# Altium project jetski-middleman.PrjPcb
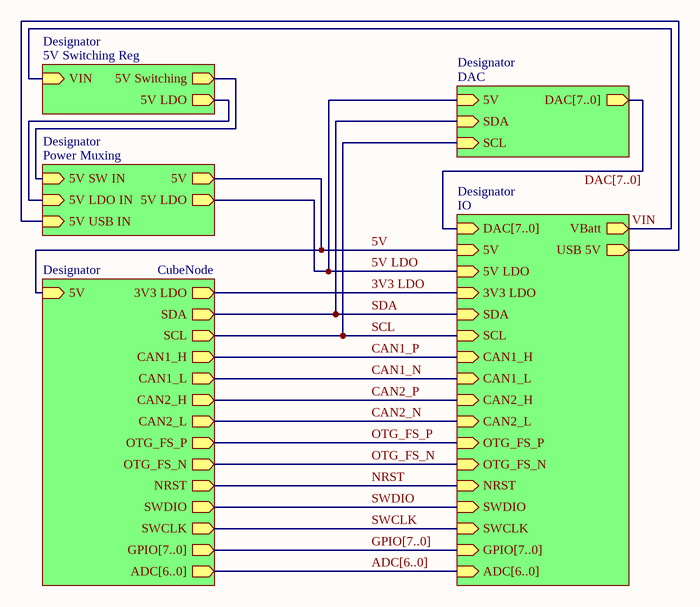
[diagram p0: top.SchDoc]
6 sheets, 37 parts. Net scope: hierarchical (ports join the sheet entries above them; power ports are global).
Board file: main.PcbDoc
Sheets:
  top.SchDoc
    Designator = 5V Switching Reg.SchDoc
    Designator = DAC.SchDoc
    Designator = IO.SchDoc
    Designator = CubeNode.SchDoc
    Designator = Power Muxing.SchDoc

## Sheet top.SchDoc
size A4; SheetNumber: 1; SheetTotal: 6

### Sub-sheets
Designator = 5V Switching Reg: 5V Switching (out), VIN (in), 5V LDO (out)
Designator = DAC: SCL (in), SDA (in), 5V (in), DAC[7..0] (out)
Designator = IO: DAC[7..0] (in), 5V LDO (in), VBatt (out), 5V (in), USB 5V (out), SDA (in), SCL (in), GPIO[7..0] (in), CAN1_H (in), CAN1_L (in), OTG_FS_P (in), OTG_FS_N (in), ADC[6..0] (in), CAN2_H (in), CAN2_L (in), SWDIO (in), SWCLK (in), NRST (in), 3V3 LDO (in)
Designator = CubeNode: 5V (in), 3V3 LDO (out), GPIO[7..0] (out), ADC[6..0] (out), SWDIO (out), SWCLK (out), SDA (out), SCL (out), CAN1_H (out), CAN1_L (out), OTG_FS_P (out), OTG_FS_N (out), CAN2_H (out), CAN2_L (out), NRST (out)
Designator = Power Muxing: 5V USB IN (in), 5V SW IN (in), 5V (out), 5V LDO (out), 5V LDO IN (in)

### Nets
3V3 LDO: sheet Designator/3V3 LDO, sheet Designator/3V3 LDO
5V: sheet Designator/5V Switching, sheet Designator/5V SW IN
5V: sheet Designator/5V, sheet Designator/5V, sheet Designator/5V  [a separate net that carries the same name]
5V LDO: sheet Designator/5V, sheet Designator/5V LDO, sheet Designator/5V LDO  [project net 5V]
5V USB IN: sheet Designator/USB 5V, sheet Designator/5V USB IN
CAN1_N: sheet Designator/CAN1_L, sheet Designator/CAN1_L
CAN1_P: sheet Designator/CAN1_H, sheet Designator/CAN1_H
CAN2_N: sheet Designator/CAN2_L, sheet Designator/CAN2_L
CAN2_P: sheet Designator/CAN2_H, sheet Designator/CAN2_H
NRST: sheet Designator/NRST, sheet Designator/NRST
OTG_FS_N: sheet Designator/OTG_FS_N, sheet Designator/OTG_FS_N
OTG_FS_P: sheet Designator/OTG_FS_P, sheet Designator/OTG_FS_P
SCL: sheet Designator/SCL, sheet Designator/SCL, sheet Designator/SCL
SDA: sheet Designator/SDA, sheet Designator/SDA, sheet Designator/SDA
SWCLK: sheet Designator/SWCLK, sheet Designator/SWCLK
SWDIO: sheet Designator/SWDIO, sheet Designator/SWDIO
VIN: sheet Designator/VIN, sheet Designator/VBatt
NetC7_1: sheet Designator/5V LDO, sheet Designator/5V LDO IN

### Buses and harness runs
bus ADC[6..0] = sheet Designator/ADC[6..0]
bus DAC[7..0] = sheet Designator/DAC[7..0]
bus GPIO[7..0] = sheet Designator/GPIO[7..0]

## Sheet 5V Switching Reg.SchDoc
size A4; SheetNumber: 4; SheetTotal: 6
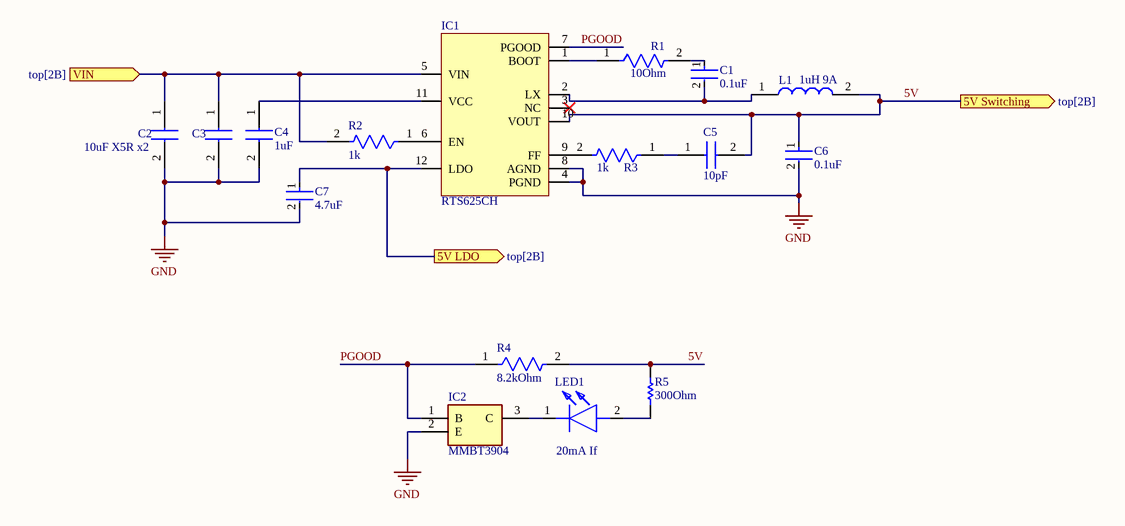
[diagram p1: 5V Switching Reg.SchDoc]

### Parts
(Parts that share a designator on the sheet are numbered #1, #2 ... from top to bottom, then left to right.)
C1#1  0.1uF  [FP-C0603C-CF-MFG]
C2#1  10uF X5R x2  [CAPC1608X90N]
C3  10uF X5R  [CAPC1608X90N]  (value not drawn)
C4  1uF  [CAPC1608X90N]
C5  10pF  [CAPC1608X95N]
C6  0.1uF  [FP-C0603C-CF-MFG]
C7  4.7uF  [FP-CL10-IPC_C]
IC1  RTS625CH  [RT6258C]
IC2#1  MMBT3904  [SOT95P240X120-3N]
L1  1uH 9A  [IFDC3030EZER1R0N]
LED1  20mA If  [KGEELP4122PHRH35A8J820R18]
R1  10Ohm  [FP-CRCW0603-C-MFG]
R2  1k  [FP-RC0603-0_55-IPC_C]
R3  1k  [FP-RC0603-0_55-IPC_C]
R4  8.2kOhm  [FP-RC0603-0_55-MFG]
R5  300Ohm  [RESC1608X55X30LL20T20]

### Ports
5V LDO (out, see top[2B]), 5V Switching (out, see top[2B]), VIN (in, see top[2B])

### Nets
GND: C2#1.2 C3.2 C4.2 C6.2 C7.2 IC1.4(PGND) IC1.8(AGND) IC2#1.2(E)
5V: C5.2 C6.1 IC1.10(VOUT) L1.2 R4.2 R5.2 ; port 5V Switching
PGOOD: IC1.7(PGOOD) IC2#1.1(B) R4.1
VIN: C2#1.1 C3.1 IC1.5(VIN) R2.2 ; port VIN
NetC1#1_1: C1#1.1 R1.2
NetC1#1_2: C1#1.2 IC1.2(LX) L1.1
NetC4_1: C4.1 IC1.11(VCC)
NetC5_1: C5.1 R3.1
NetC7_1: C7.1 IC1.12(LDO) ; port 5V LDO
NetIC1_1: IC1.1(BOOT) R1.1
NetIC1_6: IC1.6(EN) R2.1
NetIC1_9: IC1.9(FF) R3.2
NetIC2#1_3: IC2#1.3(C) LED1.1(K)
NetLED1_2: LED1.2(A) R5.1

Not connected (* = marked no-connect by the designer): IC1 3(NC)*

### Library data of the parts
C1#1 C6 = CMP-2006-03057-2: CAP CER 0.1UF 25V X7R 0603; Manufacturer Part Number: C0603C104K3RACTU; Manufacturer: KEMET; Value: 0.10 μF; Material: Ceramic; Tolerance: 0.1; Temperature Coefficient: 30ppm/°C; Automotive Grade: Grade 1; Lead Free: Yes; Device Class L3: Ceramic Capacitors; Voltage Rating: 25 V; Digikey Description: CAP CER 0.1UF 25V X7R 0603; Mouser Description: Multilayer Ceramic Capacitors MLCC - SMD/SMT 25volts 0.1uF X7R 10%; Package: C0603C-CF; Temperature Range Low: -55°C; Automotive: Yes; Device Class L2: Capacitors; Octopart: https://octopart.com/c0603c104k3ractu-kemet-127541; ComponentLink2Description: Datasheet; ComponentLink2URL: https://api.kemet.com/component-edge/download/datasheet/C0603C100J5GACAUTO.pdf; Temperature Range High: +125°C; RoHS: TRUE; Device Class L1: Passive Components; Category: Cap; Temperature: -55°C to +125°C; Capacitance: 0.10 μF; Height: 0.87mm; Temperature Characteristic: X7R
C2#1 C3 = CL10A106MA8NRNC: Capacitor; Manufacturer_Name: SAMSUNG; Datasheet Link: https://www.arrow.com/en/products/cl10a106ma8nrnc/samsung-electro-mechanics; Height: 0.9mm; Manufacturer_Part_Number: CL10A106MA8NRNC; Mouser Part Number: 187-CL10A106MA8NRNC; Mouser Price/Stock: https://www.mouser.co.uk/ProductDetail/Samsung-Electro-Mechanics/CL10A106MA8NRNC?qs=47mY1nHWefS2vFRvRJVTdQ%3D%3D; Arrow Part Number: CL10A106MA8NRNC; Arrow Price/Stock: https://www.arrow.com/en/products/cl10a106ma8nrnc/samsung-electro-mechanics?utm_currency=USD&region=nac
C4 = EMK107B7105KA-T: Capacitor; Manufacturer_Name: TAIYO YUDEN; Datasheet Link: https://componentsearchengine.com/Datasheets/1/EMK107B7105KA-T.pdf; Height: 0.9mm; Manufacturer_Part_Number: EMK107B7105KA-T; Mouser Part Number: 963-EMK107B7105KA-T; Mouser Price/Stock: https://www.mouser.co.uk/ProductDetail/TAIYO-YUDEN/EMK107B7105KA-T?qs=I6KAKw0tg2zS1zj87Lm%2FxQ%3D%3D
C5 = 0603N100J500CT: Capacitor; Manufacturer_Name: Walsin Technology Corporation; Datasheet Link: https://datasheet.datasheetarchive.com/originals/distributors/DKDS41/DSANUWW0027552.pdf; Height: 0.95mm; Manufacturer_Part_Number: 0603N100J500CT; Mouser Part Number: 791-0603N100J500CT; Mouser Price/Stock: https://www.mouser.co.uk/ProductDetail/Walsin/0603N100J500CT?qs=t1sE%252BOcWp5sS3BuqSvZ7LQ%3D%3D
C7 = CMP-13271-003017-1: Cap Ceramic 4.7uF 10V X5R ±10% Pad SMD 0603 +85°C T/R; Capacitance: 4.7uF; Case/Package: 0603; Packaging: Tape and Reel; Width: 0.031inch; Contact Plating: Tin; Thickness: 0.035inch; Package Quantity: 1; Voltage Rating: 10V; Case Code (Metric): 1608; Case Code (Imperial): 0603; Depth: 0.8mm; Height: 0.8mm; Tolerance: 10%; Max Operating Temperature: 85°C; Length: 1.6mm; Dielectric: X5R; Mount: Surface Mount; Radiation Hardening: No; Min Operating Temperature: -55°C
IC1 = RTS625CH: 5V6A SWITCHING REG WITH 5V LDO
IC2#1 = MMBT3904: Integrated Circuit; Manufacturer_Name: Diotec; Datasheet Link: https://media.digikey.com/pdf/Data%20Sheets/ON%20Semiconductor%20PDFs/2N3904,MMBT3904,PZT3904.pdf; Height: 1.2mm; Manufacturer_Part_Number: MMBT3904; Mouser Part Number: 637-MMBT3904; Mouser Price/Stock: https://www.mouser.co.uk/ProductDetail/Diotec-Semiconductor/MMBT3904?qs=OlC7AqGiEDkK1MwiyUU6mg%3D%3D; Arrow Part Number: MMBT3904; Arrow Price/Stock: https://www.arrow.com/en/products/mmbt3904/diotec-semiconductor-ag?utm_currency=USD&region=europe
L1 = IFDC3030EZER1R0N: Inductor; Manufacturer_Name: Vishay; Datasheet Link: https://www.mouser.pl/ProductDetail/Vishay/IFDC3030EZER1R0N?qs=iLKYxzqNS76W2wwIdyJsOA%3D%3D&srsltid=AfmBOoplWxOmL_1KN57dRWQGL9gAV5jJY47jYKvTr8QJ9T9ueMB2OGhk; Height: 5mm; Manufacturer_Part_Number: IFDC3030EZER1R0N; Mouser Part Number: 70-IFDC3030EZER1R0N; Mouser Price/Stock: https://www.mouser.co.uk/ProductDetail/Vishay-Dale/IFDC3030EZER1R0N?qs=iLKYxzqNS76W2wwIdyJsOA%3D%3D
LED1 = KG_EELP41.22-PHRH-35-A8J8-20-R18: LED; Manufacturer_Name: ams OSRAM; Manufacturer_Part_Number: KG EELP41.22-PHRH-35-A8J8-20-R18; Datasheet Link: https://www.farnell.com/datasheets/4386962.pdf?_gl=1*1sj7xoj*_gcl_aw*R0NMLjE3Mzc3MDQxMzMuRUFJYUlRb2JDaE1JdjdQa2l1eU5pd01WV291REJ4MzJTQ3RhRUFBWUFpQUFFZ0xCUGZEX0J3RQ..*_gcl_au*OTQ1Mjk2NjYxLjE3MzU1NTg3NDQ.; Height: 0.5mm; Mouser Part Number: 720-P4122PHRH35A8J82; Mouser Price/Stock: https://www.mouser.co.uk/ProductDetail/ams-OSRAM/KG-EELP41.22-PHRH-35-A8J8-20-R18?qs=ZcfC38r4Posajg8ZvCDQkg%3D%3D; Arrow Part Number: KG EELP41.22-PHRH-35-A8J8-20-R18; Arrow Price/Stock: https://www.arrow.com/en/products/kg-eelp41.22-phrh-35-a8j8-20-r18/ams-osram?utm_currency=USD&region=nac
R1 = CMP-02407-011565-1: RES SMD 10 OHM 1% 1/10W 0603; Resistance: 10R; Power Rating: 100mW; Lead Free: Lead Free; Case/Package: 0603; RoHS Compliant: Yes; Tolerance: 1%
R2 R3 = CMP-1659-00009-5: RES 1K OHM 1% 1/10W 0603; Resistance: 1kR; Voltage Rating: 50V; Power Rating: 100mW; Temperature Coefficient: 100ppm/°C; Military Standard: Not; REACH SVHC: No SVHC; Size Code: 0603; Features: Moisture Resistant; Number of Terminations: 2; Technology: THICK FILM; Series: RC; Case Code (Metric): 1608; Resistance Tolerance: 1%; Resistor Type: Thick Film; Termination: SMD/SMT; Contact Plating: Tin; Radiation Hardening: No; Min Operating Temperature: -55°C; Max Operating Temperature: 155°C; Packaging: Tape and Reel; Max Power Dissipation: 100mW; RoHS Compliant: Yes; Height: 0.45mm; Lead Free: Lead Free; Case/Package: 0603; Length: 1.6mm; Tolerance: 1%; Case Code (Imperial): 0603; Construction: Rectangular; Depth: 0.8mm
R4 = CMP-1659-00040-2: NexarPartId: 40301092; Voltage Rating (AC): 50V; Resistance: 8.2kΩ; Power Rating: 100mW; Temperature Coefficient: 100ppm/°C; Tolerance: 1%; Number of Terminations: 2; Length: 1.6mm; Height: 450µm; Composition: Thick Film; Case Code (Imperial): 0603; Features: Moisture Resistant; Width: 800µm; Max Operating Temperature: 155°C; Lead Pitch: 300µm; Voltage Rating: 50V; Termination: SMD/SMT; Case Code (Metric): 1608; Max Power Dissipation: 100mW; REACH SVHC: No SVHC; Number of Pins: 2; Min Operating Temperature: -55°C; Case/Package: 0603; Packaging: Tape & Reel; Voltage Rating (DC): 50V; Schedule B: 8533210045, 8533210045; Lead Free: Lead Free; RoHS: Compliant; Military Standard: Not; Depth: 800µm
R5 = CMP-2000-00025-1: Part Number: ERA3AEB301V; Manufacturer: Panasonic

## Sheet DAC.SchDoc
size A4; SheetNumber: 5; SheetTotal: 6
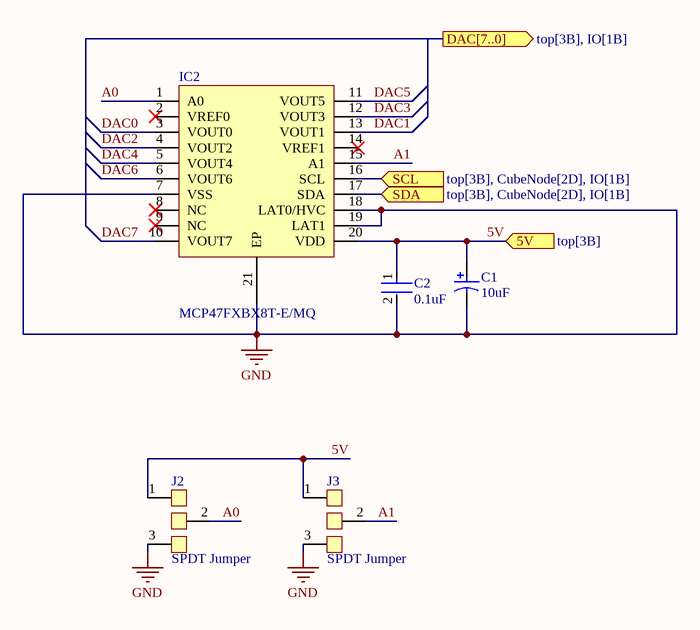
[diagram p2: DAC.SchDoc]

### Parts
(Parts that share a designator on the sheet are numbered #1, #2 ... from top to bottom, then left to right.)
C1#2  10uF  [KEMT-A-3216-18-2_M]
C2#2  0.1uF  [FP-GRM033-0_03-MFG]
IC2#2  MCP47FXBX8T-E/MQ  [MCP47FXBX8T-E/MQ]
J2  SPDT Jumper  [SPDT Jumper]
J3#1  SPDT Jumper  [SPDT Jumper]

### Ports
5V (in, see top[3B]), DAC[7..0] (out, see top[3B], IO[1B]), SCL (in, see top[3B], CubeNode[2D], IO[1B]), SDA (in, see top[3B], CubeNode[2D], IO[1B])

### Nets
GND: C1#2.2 C2#2.2 IC2#2.7(VSS) IC2#2.18(LAT0/HVC) IC2#2.19(LAT1) IC2#2.21(EP) J2.3 J3#1.3
5V: C1#2.1 C2#2.1 IC2#2.20(VDD) J2.1 J3#1.1 ; port 5V
A0: IC2#2.1(A0) J2.2
A1: IC2#2.15(A1) J3#1.2
DAC0: IC2#2.3(VOUT0)
DAC1: IC2#2.13(VOUT1)
DAC2: IC2#2.4(VOUT2)
DAC3: IC2#2.12(VOUT3)
DAC4: IC2#2.5(VOUT4)
DAC5: IC2#2.11(VOUT5)
DAC6: IC2#2.6(VOUT6)
DAC7: IC2#2.10(VOUT7)
SCL: IC2#2.16(SCL) ; port SCL
SDA: IC2#2.17(SDA) ; port SDA

Not connected (* = marked no-connect by the designer): IC2#2 2(VREF0)* 8(NC)* 9(NC)* 14(VREF1)*

### Library data of the parts
C1#2 = CMP-2000-05172-1: Capacitor, Tantalum, 10 uF, +/- 10%, 10 V, -55 to 125 degC, 2-Pin SMD (1206), RoHS, Tape and Reel; Manufacturer Size Code: A; Manufacturer: Kemet; Type: Molded; Online Catalog: T491Series; Other Names: 399-3684-2; Voltage - Rated: 10V; Lifetime @ Temp.: 2000Hrs@85degC; Product Training Modules: CapacitorBasics-TypicalUsesforCapacitorsDeratingGuidelinesforSurfaceMountTantalumCapacitors; ESR (Equivalent Series Resistance): 3.8Ohm; Capacitance: 10µF; Catalog Drawings: T49x,T5xxSeries_A-side1T49x,T5xxSeries_A,B-side2T49x,T5xxSeries_A,SBottom; Family: TantalumCapacitors; Manufacturer URL: http://www.kemet.com/; Datasheet URL: http://www.farnell.com/datasheets/1824869.pdf; Package Reference: 1206; Packaging: Tape&Reel(TR); Series: T491; Operating Temperature: -55degC~125degC; Mounting Type: SurfaceMount; Height - Seated (Max): 0.071"(1.80mm); Package / Case: 1206(3216Metric); Package Description: 2-Pin Surface Mount Device, Body 3.2 x 1.6 mm; Features: GeneralPurpose; Tolerance: ±10%; Lead Spacing: -; Size / Dimension: 0.126"Lx0.063"W(3.20mmx1.60mm); Standard Package: 2,000; Datasheet Version: Apr-14; Category: Capacitors
C2#2 = CMP-06035-000062-2: Chip Multilayer Ceramic Capacitors for General Purpose, 0201, 0.10uF, X5R, 15%, 10%, 6.3V; Capacitance: 100nF; Min Operating Temperature: -55°C; Lead Free: Lead Free; Radiation Hardening: No; Dielectric: X5R; Voltage Rating (DC): 6.3V; REACH SVHC: No SVHC; Case/Package: 0201; Voltage Rating: 6.3V; Length: 0.6mm; Max Operating Temperature: 85°C; Width: 0.012inch; Depth: 0.3mm; Material: Ceramic; Case Code (Metric): 0603; Thickness: 0.013inch; Packaging: Tape and Reel; Height: 0.3mm; Weight: 6E-06oz; Package Quantity: 1; Mount: Surface Mount; Voltage: 6.3V; Case Code (Imperial): 0201; Tolerance: 10%; Termination: SMD/SMT

## Sheet IO.SchDoc
size A4; SheetNumber: 3; SheetTotal: 6
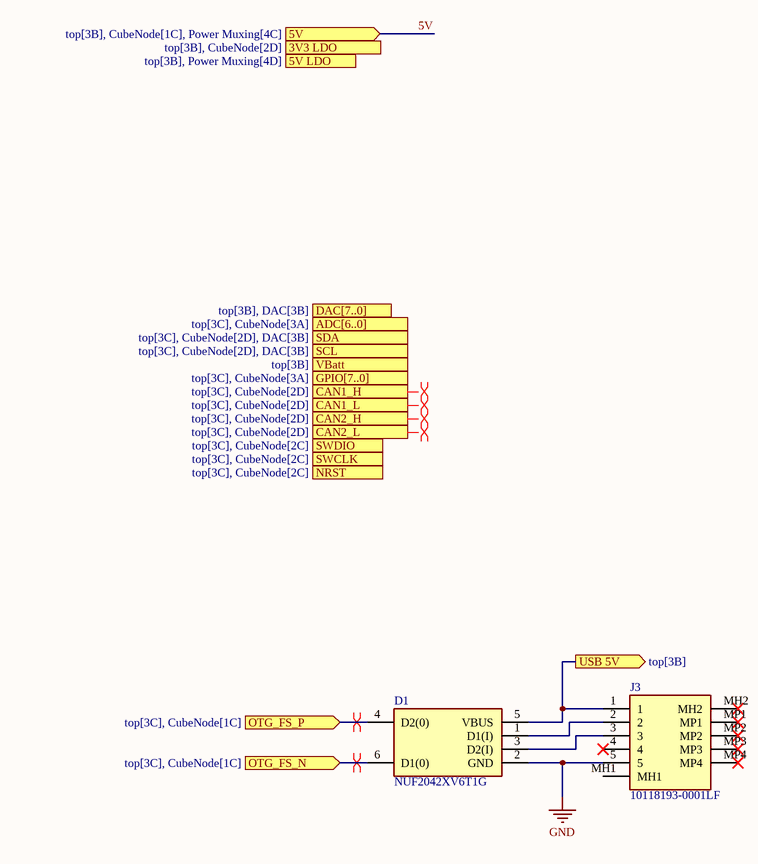
[diagram p3: IO.SchDoc]

### Parts
(Parts that share a designator on the sheet are numbered #1, #2 ... from top to bottom, then left to right.)
D1  NUF2042XV6T1G  [SOTFL50P160X60-6N]
J3#2  10118193-0001LF  [101181930001LF]

### Ports
3V3 LDO (in, see top[3B], CubeNode[2D]), 5V (in, see top[3B], CubeNode[1C], Power Muxing[4C]), 5V LDO (in, see top[3B], Power Muxing[4D]), ADC[6..0] (in, see top[3C], CubeNode[3A]), CAN1_H (in, see top[3C], CubeNode[2D]), CAN1_L (in, see top[3C], CubeNode[2D]), CAN2_H (in, see top[3C], CubeNode[2D]), CAN2_L (in, see top[3C], CubeNode[2D]), DAC[7..0] (in, see top[3B], DAC[3B]), GPIO[7..0] (in, see top[3C], CubeNode[3A]), NRST (in, see top[3C], CubeNode[2C]), OTG_FS_N (in, see top[3C], CubeNode[1C]), OTG_FS_P (in, see top[3C], CubeNode[1C]), SCL (in, see top[3C], CubeNode[2D], DAC[3B]), SDA (in, see top[3C], CubeNode[2D], DAC[3B]), SWCLK (in, see top[3C], CubeNode[2C]), SWDIO (in, see top[3C], CubeNode[2C]), USB 5V (out, see top[3B]), VBatt (out, see top[3B])

### Nets
GND: D1.2(GND) J3#2.5
5V USB IN: D1.5(VBUS) J3#2.1 ; port USB 5V
OTG_FS_N: D1.6(D1(0)) ; port OTG_FS_N
OTG_FS_P: D1.4(D2(0)) ; port OTG_FS_P
NetD1_1: D1.1(D1(I)) J3#2.2
NetD1_3: D1.3(D2(I)) J3#2.3

Not connected (* = marked no-connect by the designer): J3#2 4* MH1 MH2* MP1* MP2* MP3* MP4*

### Layout directives
differential pair: CAN1_N, CAN1_P, CAN2_N, CAN2_P, OTG_FS_N, OTG_FS_P

### Library data of the parts
D1 = NUF2042XV6T1G: Diode; Manufacturer_Name: onsemi; Datasheet Link: https://www.onsemi.com/pub/Collateral/NUF2030XV6-D.PDF; Height: 0.6mm; Manufacturer_Part_Number: NUF2042XV6T1G; Mouser Part Number: 863-NUF2042XV6T1G; Mouser Price/Stock: https://www.mouser.co.uk/ProductDetail/onsemi/NUF2042XV6T1G?qs=ZXBb0xZ9WeAV3XcAwewBSw%3D%3D; Arrow Part Number: NUF2042XV6T1G; Arrow Price/Stock: https://www.arrow.com/en/products/nuf2042xv6t1g/on-semiconductor?region=europe
J3#2 = 10118193-0001LF: Connector; Manufacturer_Name: Amphenol Communications Solutions; Datasheet Link: https://cdn.amphenol-cs.com/media/wysiwyg/files/drawing/10118193.pdf; Height: 3.3mm; Manufacturer_Part_Number: 10118193-0001LF; Arrow Part Number: 10118193-0001LF; Arrow Price/Stock: https://www.arrow.com/en/products/10118193-0001lf/amphenol-fci?utm_currency=USD&region=europe

## Sheet CubeNode.SchDoc
size A4; SheetNumber: 2; SheetTotal: 6
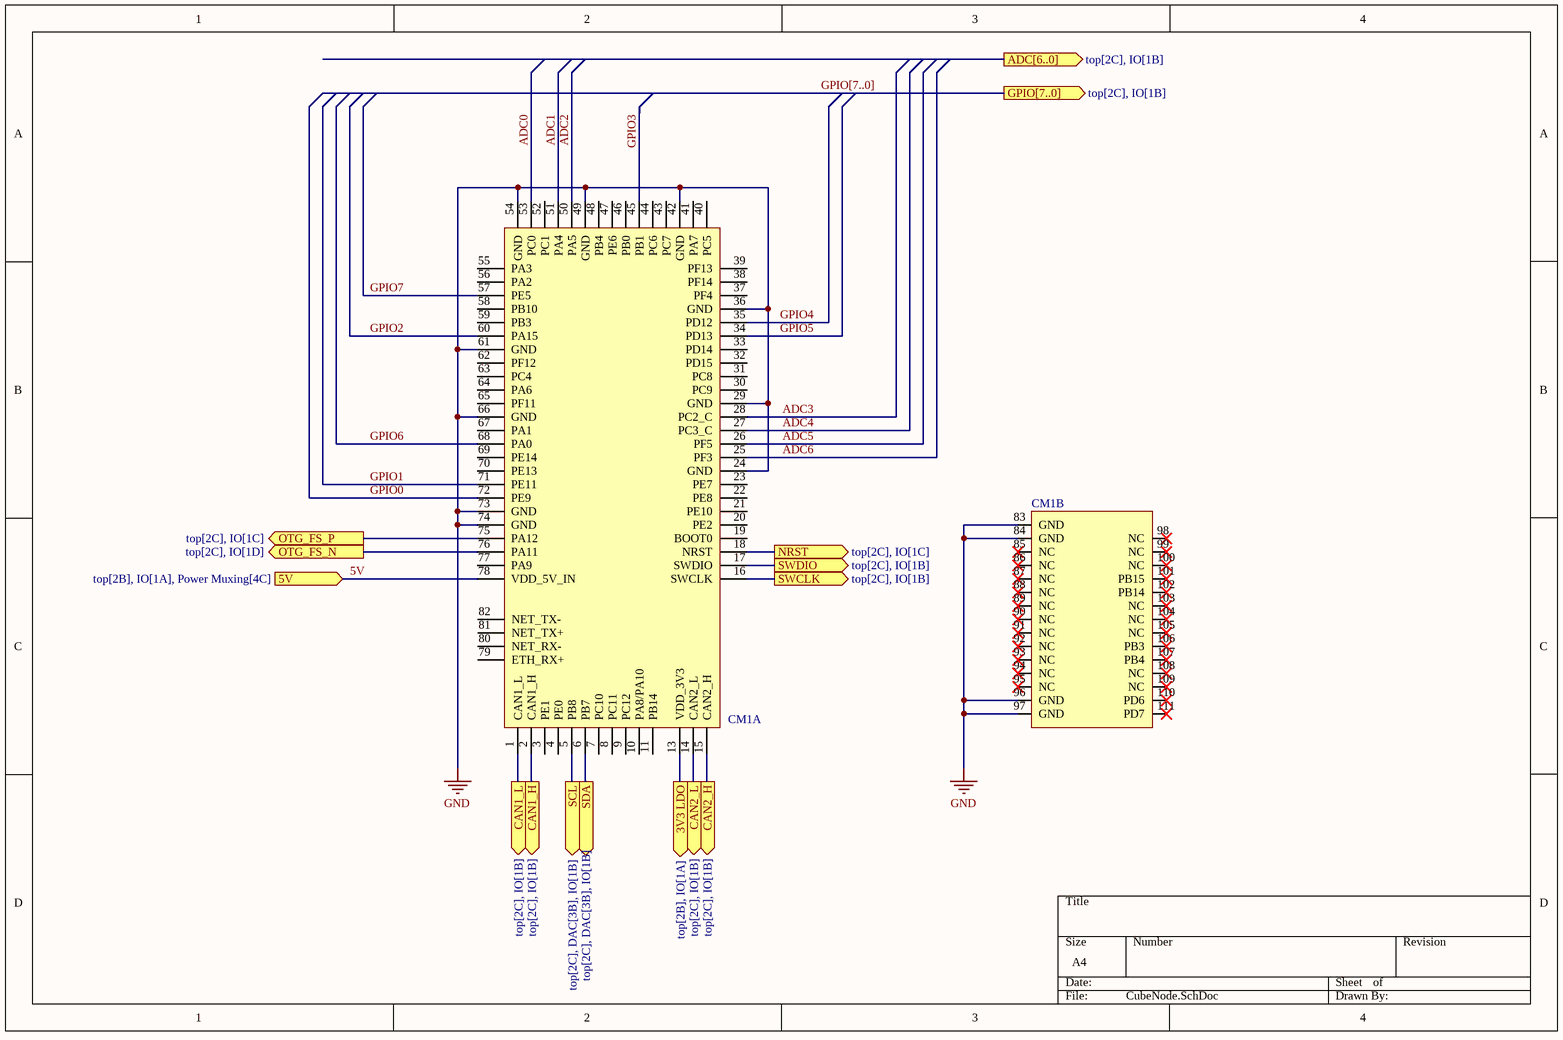
[diagram p4: CubeNode.SchDoc]

### Parts
CM1  CUBENODE_FOOTPRINT  [CubeNode]  (value not drawn)  (parts A,B of 2)  (no BOM)

### Ports
3V3 LDO (out, see top[2B], IO[1A]), 5V (in, see top[2B], IO[1A], Power Muxing[4C]), ADC[6..0] (out, see top[2C], IO[1B]), CAN1_H (out, see top[2C], IO[1B]), CAN1_L (out, see top[2C], IO[1B]), CAN2_H (out, see top[2C], IO[1B]), CAN2_L (out, see top[2C], IO[1B]), GPIO[7..0] (out, see top[2C], IO[1B]), NRST (out, see top[2C], IO[1C]), OTG_FS_N (out, see top[2C], IO[1D]), OTG_FS_P (out, see top[2C], IO[1C]), SCL (out, see top[2C], DAC[3B], IO[1B]), SDA (out, see top[2C], DAC[3B], IO[1B]), SWCLK (out, see top[2C], IO[1B]), SWDIO (out, see top[2C], IO[1B])

### Nets
GND: CM1.24(GND) CM1.29(GND) CM1.36(GND) CM1.42(GND) CM1.49(GND) CM1.54(GND) CM1.61(GND) CM1.66(GND) CM1.73(GND) CM1.74(GND) CM1.83(GND) CM1.84(GND) CM1.96(GND) CM1.97(GND)
3V3 LDO: CM1.13(VDD_3V3) ; port 3V3 LDO
5V: CM1.78(VDD_5V_IN) ; port 5V
ADC0: CM1.53(PC0)
ADC1: CM1.51(PA4)
ADC2: CM1.50(PA5)
ADC3: CM1.28(PC2_C)
ADC4: CM1.27(PC3_C)
ADC5: CM1.26(PF5)
ADC6: CM1.25(PF3)
CAN1_N: CM1.1(CAN1_L) ; port CAN1_L
CAN1_P: CM1.2(CAN1_H) ; port CAN1_H
CAN2_N: CM1.14(CAN2_L) ; port CAN2_L
CAN2_P: CM1.15(CAN2_H) ; port CAN2_H
GPIO0: CM1.72(PE9)
GPIO1: CM1.71(PE11)
GPIO2: CM1.60(PA15)
GPIO3: CM1.45(PB1)
GPIO4: CM1.35(PD12)
GPIO5: CM1.34(PD13)
GPIO6: CM1.68(PA0)
GPIO7: CM1.57(PE5)
NRST: CM1.18(NRST) ; port NRST
OTG_FS_N: CM1.76(PA11) ; port OTG_FS_N
OTG_FS_P: CM1.75(PA12) ; port OTG_FS_P
SCL: CM1.5(PB8) ; port SCL
SDA: CM1.6(PB7) ; port SDA
SWCLK: CM1.16(SWCLK) ; port SWCLK
SWDIO: CM1.17(SWDIO) ; port SWDIO

Not connected (* = marked no-connect by the designer): CM1 3(PE1) 4(PE0) 7(PC10) 8(PC11) 9(PC12) 10(PA8/PA10) 11(PB14) 19(BOOT0) 20(PE2) 21(PE10) 22(PE8) 23(PE7) 30(PC9) 31(PC8) 32(PD15) 33(PD14) 37(PF4) 38(PF14) 39(PF13) 40(PC5) 41(PA7) 43(PC7) 44(PC6) 46(PB0) 47(PE6) 48(PB4) 52(PC1) 55(PA3) 56(PA2) 58(PB10) 59(PB3) 62(PF12) 63(PC4) 64(PA6) 65(PF11) 67(PA1) 69(PE14) 70(PE13) 77(PA9) 79(ETH_RX+) 80(NET_RX-) 81(NET_TX+) 82(NET_TX-) 85(NC)* 86(NC)* 87(NC)* 88(NC)* 89(NC)* 90(NC)* 91(NC)* 92(NC)* 93(NC)* 94(NC)* 95(NC)* 98(NC)* 99(NC)* 100(NC)* 101(PB15)* 102(PB14)* 103(NC)* 104(NC)* 105(NC)* 106(PB3)* 107(PB4)* 108(NC)* 109(NC)* 110(PD6)* 111(PD7)*

### Buses and harness runs
bus GPIO[7..0] = port GPIO[7..0]

### Library data of the parts
CM1 = CubeNode Footprint

## Sheet Power Muxing.SchDoc
size A4; SheetNumber: 6; SheetTotal: 6
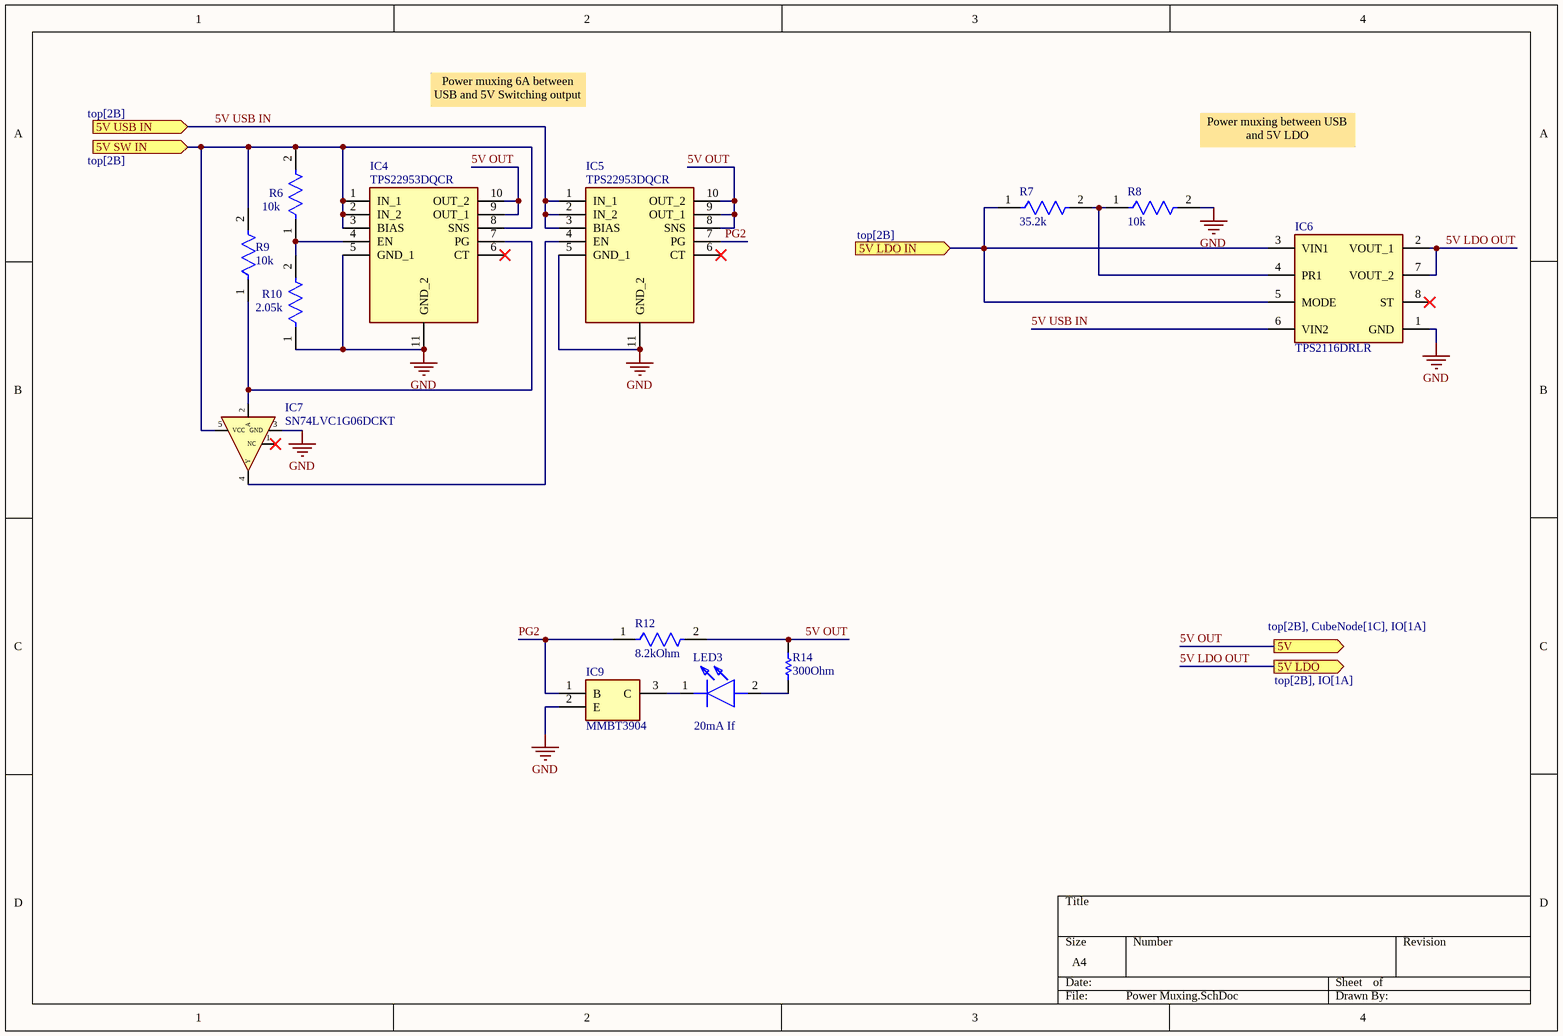
[diagram p5: Power Muxing.SchDoc]

### Parts
IC4  TPS22953DQCR  [SON50P200X300X80-11N]
IC5  TPS22953DQCR  [SON50P200X300X80-11N]
IC6  TPS2116DRLR  [8PIN-SOT-5x3]
IC7  SN74LVC1G06DCKT  [5PIN-SC70]
IC9  MMBT3904  [SOT95P240X120-3N]
LED3  20mA If  [KGEELP4122PHRH35A8J820R18]
R6  10k  [FP-AF0603-MFG]
R7  35.2k  [FP-RC0603-0_55-IPC_A]
R8  10k  [FP-RC0603-0_55-IPC_C]
R9  10k  [FP-AF0603-MFG]
R10  2.05k  [FP-AF0603-MFG]
R12  8.2kOhm  [FP-RC0603-0_55-MFG]
R14  300Ohm  [RESC1608X55X30LL20T20]

### Ports
5V (out, see top[2B], CubeNode[1C], IO[1A]), 5V LDO (out, see top[2B], IO[1A]), 5V LDO IN (in, see top[2B]), 5V SW IN (in, see top[2B]), 5V USB IN (in, see top[2B])

### Nets
GND: IC4.5(GND_1) IC4.11(GND_2) IC5.5(GND_1) IC5.11(GND_2) IC6.1(GND) IC7.3(GND) IC9.2(E) R8.2 R10.1
5V: IC4.1(IN_1) IC4.2(IN_2) IC4.3(BIAS) IC4.8(SNS) IC7.5(VCC) R6.2 R9.2 ; port 5V SW IN
5V LDO OUT: IC6.2(VOUT_1) IC6.7(VOUT_2) ; port 5V LDO  [project net 5V]
5V OUT: IC4.9(OUT_1) IC4.10(OUT_2) IC5.8(SNS) IC5.9(OUT_1) IC5.10(OUT_2) R12.2 R14.2 ; port 5V  [project net 5V]
5V USB IN: IC5.1(IN_1) IC5.2(IN_2) IC5.3(BIAS) IC6.6(VIN2) ; port 5V USB IN
PG2: IC5.7(PG) IC9.1(B) R12.1
NetC7_1: IC6.3(VIN1) IC6.5(MODE) R7.1 ; port 5V LDO IN
NetIC4_4: IC4.4(EN) R6.1 R10.2
NetIC4_7: IC4.7(PG) IC7.2(A) R9.1
NetIC5_4: IC5.4(EN) IC7.4(Y)
NetIC6_4: IC6.4(PR1) R7.2 R8.1
NetIC9_3: IC9.3(C) LED3.1(K)
NetLED3_2: LED3.2(A) R14.1

Not connected (* = marked no-connect by the designer): IC4 6(CT)*; IC5 6(CT)*; IC6 8(ST)*; IC7 1(NC)*

### Notes on the sheet
- Power muxing 6A between USB and 5V Switching output
- Power muxing between USB and 5V LDO

### Library data of the parts
IC4 IC5 = TPS22953DQCR: Integrated Circuit; Manufacturer_Name: Texas Instruments; Datasheet Link: https://www.ti.com/lit/ds/symlink/tps22953.pdf?ts=1619606232254&ref_url=https%253A%252F%252Fwww.ti.com%252Fstore%252Fti%252Fen%252Fp%252Fproduct%252F%253Fp%253DTPS22953DQCR; Height: 0.8mm; Manufacturer_Part_Number: TPS22953DQCR; Mouser Part Number: 595-TPS22953DQCR; Mouser Price/Stock: https://www.mouser.co.uk/ProductDetail/Texas-Instruments/TPS22953DQCR?qs=lGsJEpdjMw2%2Fit%2FtgfzifQ%3D%3D; Arrow Part Number: TPS22953DQCR; Arrow Price/Stock: https://www.arrow.com/en/products/tps22953dqcr/texas-instruments?utm_currency=USD&region=nac
IC6 = TPS2116DRLR: Integrated Circuit; Manufacturer_Name: Texas Instruments; Description: d; Datasheet Link: https://www.ti.com/lit/gpn/tps2116; Height: 0.6mm; Manufacturer_Part_Number: TPS2116DRLR; Mouser Part Number: 595-TPS2116DRLR; Mouser Price/Stock: https://www.mouser.co.uk/ProductDetail/Texas-Instruments/TPS2116DRLR?qs=aP1CjGhiNiGo3XAyXcVPaQ%3D%3D; Arrow Part Number: TPS2116DRLR; Arrow Price/Stock: https://www.arrow.com/en/products/tps2116drlr/texas-instruments?utm_currency=USD&region=nac
IC7 = SN74LVC1G06DCKT: Integrated Circuit; Manufacturer_Name: Texas Instruments; Datasheet Link: http://www.ti.com/lit/gpn/sn74lvc1g06; Height: 1.1mm; Manufacturer_Part_Number: SN74LVC1G06DCKT; Mouser Part Number: 595-SN74LVC1G06DCKT; Mouser Price/Stock: https://www.mouser.co.uk/ProductDetail/Texas-Instruments/SN74LVC1G06DCKT?qs=pajgIaoyDUgT6MJoS5pgkQ%3D%3D; Arrow Part Number: SN74LVC1G06DCKT; Arrow Price/Stock: https://www.arrow.com/en/products/sn74lvc1g06dckt/texas-instruments?region=nac
IC9 = MMBT3904: as IC2#1 on sheet 5V Switching Reg; Datasheet Link: https://media.digikey.com/pdf/Data%20Sheets/ON%20Semiconductor%20PDFs/2N3904,MMBT3904,PZT3904.pdf; Height: 1.2mm; Manufacturer_Part_Number: MMBT3904; Mouser Part Number: 637-MMBT3904; Mouser Price/Stock: https://www.mouser.co.uk/ProductDetail/Diotec-Semiconductor/MMBT3904?qs=OlC7AqGiEDkK1MwiyUU6mg%3D%3D; Arrow Part Number: MMBT3904; Arrow Price/Stock: https://www.arrow.com/en/products/mmbt3904/diotec-semiconductor-ag?utm_currency=USD&region=europe
LED3 = KG_EELP41.22-PHRH-35-A8J8-20-R18: as LED1 on sheet 5V Switching Reg; Datasheet Link: https://www.farnell.com/datasheets/4386962.pdf?_gl=1*1sj7xoj*_gcl_aw*R0NMLjE3Mzc3MDQxMzMuRUFJYUlRb2JDaE1JdjdQa2l1eU5pd01WV291REJ4MzJTQ3RhRUFBWUFpQUFFZ0xCUGZEX0J3RQ..*_gcl_au*OTQ1Mjk2NjYxLjE3MzU1NTg3NDQ.; Height: 0.5mm; Mouser Part Number: 720-P4122PHRH35A8J82; Mouser Price/Stock: https://www.mouser.co.uk/ProductDetail/ams-OSRAM/KG-EELP41.22-PHRH-35-A8J8-20-R18?qs=ZcfC38r4Posajg8ZvCDQkg%3D%3D; Arrow Part Number: KG EELP41.22-PHRH-35-A8J8-20-R18; Arrow Price/Stock: https://www.arrow.com/en/products/kg-eelp41.22-phrh-35-a8j8-20-r18/ams-osram?utm_currency=USD&region=nac
R6 R9 = CMP-03412-049106-1: Anti-Sulfurated Chip Resistors Automotive Grade 10kΩ 1% 100ppm/°C 0603
R7 = RT0603BRD0735K2L: High Precision-High Stability Chip Resistor Thin Film 0603 35.2kOhm 0.1% Paper T/R; Manufacturer: Yageo; Value: 35.2kR; Temperature Coefficient: 25ppm/°C; Max Power Dissipation: 100mW; Supplier: Digikey; Supplier Part Number: 13-RT0603BRD0735K2LCT-ND; Manufacturer Part Number: RT0603BRD0735K2L; RoHS: Yes; Category: Chip SMD Resistors; Stock: 17147; Pricing: 1=0.1, 10=0.07, 25=0.0664, 50=0.0622, 100=0.0551, 250=0.05152, 500=0.04676, 1000=0.04432 (USD); Case/Package: 0603; Min Operating Temperature: -55°C; Max Operating Temperature: 155°C; Tolerance: 0.1%; Packaging: Tape and Reel; Number of Terminations: 2; Series: RT; RoHS Compliant: Yes; ComponentLink1URL: https://www.yageo.com/upload/media/product/productsearch/datasheet/rchip/PYu-RT_1-to-0.01_RoHS_L_12.pdf?src-supplier=Digikey; ComponentLink1Description: https://www.yageo.com/upload/media/product/productsearch/datasheet/rchip/PYu-RT_1-to-0.01_RoHS_L_12.pdf?src-supplier=Digikey
R8 = CMP-2100-03664-2: RES 10K OHM 1% 1/10W 0603; Voltage Rating: 75V; Voltage Rating (DC): 50V; Resistance: 10kR; Power Rating: 100mW; Temperature Coefficient: 100ppm/°C; Depth: 0.8mm; Termination: SMD/SMT; Resistor Type: Thick Film; Series: RC; Construction: Rectangular; Features: Moisture Resistant; Packaging: Tape and Reel; Min Operating Temperature: -55°C; Number of Terminations: 2; Lead Pitch: 0.3mm; RoHS Compliant: Yes; Case/Package: 0603; Resistance Tolerance: 1%; Military Standard: Not; Weight: 7.1E-05oz; Number of Pins: 2; Tolerance: 1%; Length: 1.6mm; Case Code (Imperial): 0603; Lead Free: Lead Free; Width: 0.8mm; Max Power Dissipation: 100mW; Height: 0.45mm; Max Operating Temperature: 155°C; Case Code (Metric): 1608; Size Code: 0603
R10 = CMP-03412-038269-1: Anti-Sulfurated Chip Resistors Automotive Grade 2.05kΩ 1% 100ppm/°C 0603; Power Rating: 100mW; Resistance: 2.05kR; Voltage Rating: 75V; Case Code (Metric): 1608; Termination: SMD/SMT; Series: AF; Resistor Type: Thick Film; Features: Moisture Resistant; Case/Package: 0603; Case Code (Imperial): 0603; Size Code: 0603; Height: 0.022inch; Number of Terminations: 2; Weight: 7.1E-05oz; Width: 0.8mm; Min Operating Temperature: -55°C; Package Quantity: 5000; Tolerance: 1%; RoHS Compliant: Yes; Packaging: Tape and Reel; Temperature Coefficient: 100ppm/°C; Max Power Dissipation: 100mW; Lead Free: Lead Free; Length: 0.063inch; Max Operating Temperature: 155°C
R12 = CMP-1659-00040-2: as R4 on sheet 5V Switching Reg; Number of Terminations: 2; Length: 1.6mm; Height: 450µm; Composition: Thick Film; Case Code (Imperial): 0603; Features: Moisture Resistant; Width: 800µm; Max Operating Temperature: 155°C; Lead Pitch: 300µm; Voltage Rating: 50V; Termination: SMD/SMT; Case Code (Metric): 1608; Max Power Dissipation: 100mW; REACH SVHC: No SVHC; Number of Pins: 2; Min Operating Temperature: -55°C; Case/Package: 0603; Packaging: Tape & Reel; Voltage Rating (DC): 50V; Schedule B: 8533210045, 8533210045; Lead Free: Lead Free; RoHS: Compliant; Military Standard: Not; Depth: 800µm
R14 = CMP-2000-00025-1: as R5 on sheet 5V Switching Reg

## Nets that join several sheets
GND: 5V Switching Reg (8 pins), DAC (8 pins), IO (D1.2 J3#2.5), CubeNode (14 pins), Power Muxing (9 pins)
5V: 5V Switching Reg (6 pins), Power Muxing (7 pins)
5V: DAC (5 pins), Power Muxing (IC6.2 IC6.7)
5V: CubeNode (CM1.78), Power Muxing (7 pins)
5V USB IN: IO (D1.5 J3#2.1), Power Muxing (IC5.1 IC5.2 IC5.3 IC6.6)
NetC7_1: 5V Switching Reg (C7.1 IC1.12), Power Muxing (IC6.3 IC6.5 R7.1)
OTG_FS_N: IO (D1.6), CubeNode (CM1.76)
OTG_FS_P: IO (D1.4), CubeNode (CM1.75)
SCL: DAC (IC2#2.16), CubeNode (CM1.5)
SDA: DAC (IC2#2.17), CubeNode (CM1.6)